# EAGLE design TSL230RD_breakout (EAGLE 7.3.0)
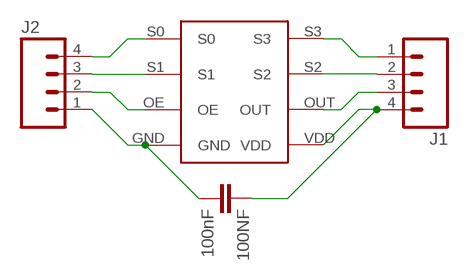
[diagram p0: schematic, sheet 1]

## Parts
100NF  100nF  CAP0603-CAP  [0603-CAP]
J1  M04PTH  [1X04]
J2  M04PTH  [1X04]
U$1  TSL230RDSMD  [TSL230RD]

## Nets
N$1: J2.4 U$1.S0
N$2: J2.3 U$1.S1
N$3: J2.2 U$1.OE
N$4: 100NF.2 J2.1 U$1.GND
N$5: J1.1 U$1.S3
N$6: J1.2 U$1.S2
N$7: J1.3 U$1.OUT
N$8: 100NF.1 J1.4 U$1.VDD

## Library data of the parts
100NF = SparkFun-Capacitors:CAP: Capacitor Standard 0603 ceramic capacitor, and 0.1" leaded capacitor.
J1 J2 = SparkFun-Connectors:M04: Header 4 Standard 4-pin 0.1" header. Use with straight break away headers (SKU : PRT-00116), right angle break away headers (PRT-00553), swiss pins (PRT-00743), machine pins (PRT-00117), and female headers (PRT-00115). Molex polarized connector foot print use with SKU : PRT-08231 with associated crimp pins and housings. 1MM SMD Version SKU: PRT-10208; PROD_ID: CONN-09696
U$1 = awqua_eagle_library:TSL230RD

## Board
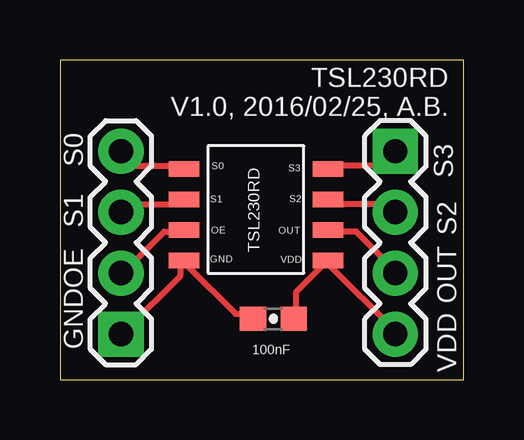
[diagram p1: board, top side]

Size 16.82 x 13.32 mm. Coordinates in mm from the lower left corner, seen from the top.
Outline: 0,0 16.82,0 16.82,13.32 0,13.32 0,0
Copper layers (1*16): Top 0.035mm / dielectric 1.5mm / Bottom 0.035mm
Design rules "default": minimum track width 10mil, minimum drill 24mil, track to track 8mil, track to pad 8mil, pad to pad 8mil, via to via 8mil, smd to smd 8mil, copper to edge 40mil, drill to drill 8mil, minimum pad ring 10mil, minimum via ring 8mil, stop-mask expansion 4mil, vias tented up to drill 0mil, thermal gap 10mil

### Footprints (pad centres in the part's own frame; a part is rotated, then mirrored left to right if it is on the bottom)
0603-CAP = smd 1.1 x 1: 1 -0.85,0; 2 0.85,0
1X04 = drill 1.016 pad 1.88 square: 1 0,0 | drill 1.016 pad 1.88: 2 2.54,0; 3 5.08,0; 4 7.62,0
TSL230RD = smd 0.635 x 1.27: GND 0.53,5; OE 1.8,5; OUT 1.8,-1; S0 4.34,5; S1 3.07,5; S2 3.07,-1; S3 4.34,-1; VDD 0.53,-1

### Placement (x,y rotation side)
100NF  8.89,2.54 180 top
J1  13.97,9.53 270 top
J2  2.54,1.91 90 top
U$1  10.16,4.45 90 top

### Tracks (layer width: path | path; a pad name or v marks a point on that pad's centre or on a via)
N$1
  Top 0.254: U$1.S0 5.03,8.91 3.2,8.91 2.74,9.37 J2.4
N$2
  Top 0.254: U$1.S1 5.03,7.32 2.97,7.32 2.74,7.09 J2.3
N$3
  Top 0.254: U$1.OE 5.03,6.17 4.34,6.17 2.74,4.57 J2.2
N$4
  Top 0.254: 100NF.2 8,2.74 7.32,2.74 5.26,4.8 U$1.GND 5.03,4.8 5.03,4.34 2.74,2.06 J2.1
N$5
  Top 0.254: U$1.S3 11.2,8.91 13.49,8.91 13.95,9.37 J1.1
N$6
  Top 0.254: U$1.S2 11.2,7.32 13.72,7.32 13.95,7.09 J1.2
N$7
  Top 0.254: U$1.OUT 11.2,6.17 12.34,6.17 13.95,4.57 J1.3
N$8
  Top 0.254: 100NF.1 9.83,2.74 9.83,3.66 10.97,4.8 U$1.VDD 11.2,4.8 13.95,2.06 J1.4

### Text on the board
tPlace: TSL230RD / V1.0, 2016/02/25, A.B. | S3 | S0 | S1 | S2 | OE | OUT | GND | VDD